# Altium schematic sheet rp3a0-mini-gpio.SchDoc
size A4; SheetNumber: 3; SheetTotal: 6
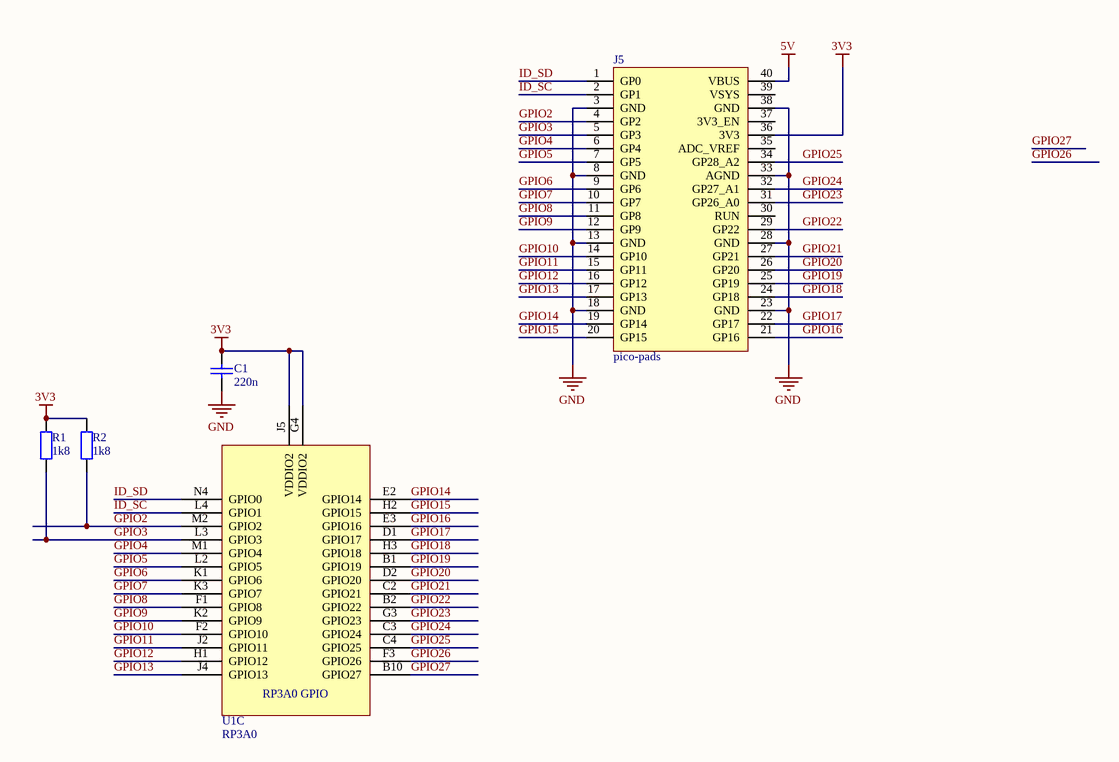
[diagram p0: rp3a0-mini-gpio.SchDoc]

## Parts
C1  value 220n  [0402]  (hidden comment: Cap)
J5  pico-pads  [PICO_PADS]
R1  value 1k8  [RES-0402-SML]  (hidden comment: Res SMD)
R2  value 1k8  [RES-0402-SML]  (hidden comment: Res SMD)
U1  RP3A0  [RP3A0-BGA]  (part C of 8)

## Nets
3V3: C1.2 J5.36(3V3) R1.2 R2.2 U1.G4(VDDIO2) U1.J5(VDDIO2)
5V: J5.40(VBUS)
GND: C1.1 J5.3(GND) J5.8(GND) J5.13(GND) J5.18(GND) J5.23(GND) J5.28(GND) J5.33(AGND) J5.38(GND)
GPIO2: J5.4(GP2) R2.1 U1.M2(GPIO2)
GPIO3: J5.5(GP3) R1.1 U1.L3(GPIO3)
GPIO4: J5.6(GP4) U1.M1(GPIO4)
GPIO5: J5.7(GP5) U1.L2(GPIO5)
GPIO6: J5.9(GP6) U1.K1(GPIO6)
GPIO7: J5.10(GP7) U1.K3(GPIO7)
GPIO8: J5.11(GP8) U1.F1(GPIO8)
GPIO9: J5.12(GP9) U1.K2(GPIO9)
GPIO10: J5.14(GP10) U1.F2(GPIO10)
GPIO11: J5.15(GP11) U1.J2(GPIO11)
GPIO12: J5.16(GP12) U1.H1(GPIO12)
GPIO13: J5.17(GP13) U1.J4(GPIO13)
GPIO14: J5.19(GP14) U1.E2(GPIO14)
GPIO15: J5.20(GP15) U1.H2(GPIO15)
GPIO16: J5.21(GP16) U1.E3(GPIO16)
GPIO17: J5.22(GP17) U1.D1(GPIO17)
GPIO18: J5.24(GP18) U1.H3(GPIO18)
GPIO19: J5.25(GP19) U1.B1(GPIO19)
GPIO20: J5.26(GP20) U1.D2(GPIO20)
GPIO21: J5.27(GP21) U1.C2(GPIO21)
GPIO22: J5.29(GP22) U1.B2(GPIO22)
GPIO23: J5.31(GP26_A0) U1.G3(GPIO23)
GPIO24: J5.32(GP27_A1) U1.C3(GPIO24)
GPIO25: J5.34(GP28_A2) U1.C4(GPIO25)
GPIO26: U1.F3(GPIO26)
GPIO27: U1.B10(GPIO27)
ID_SC: J5.2(GP1) U1.L4(GPIO1)
ID_SD: J5.1(GP0) U1.N4(GPIO0)

Not connected (* = marked no-connect by the designer): J5 30(RUN) 35(ADC_VREF) 37(3V3_EN) 39(VSYS)

## Notes on the sheet
- (in symbol RP3A0, part C) RP3A0 GPIO

## Library data of the parts
C1 = CAP-NONPOL: Capacitor
R1 R2 = Res SMD: Resistor